# Altium schematic sheet Nucleo.SchDoc
size A; SheetNumber: 6; SheetTotal: 5
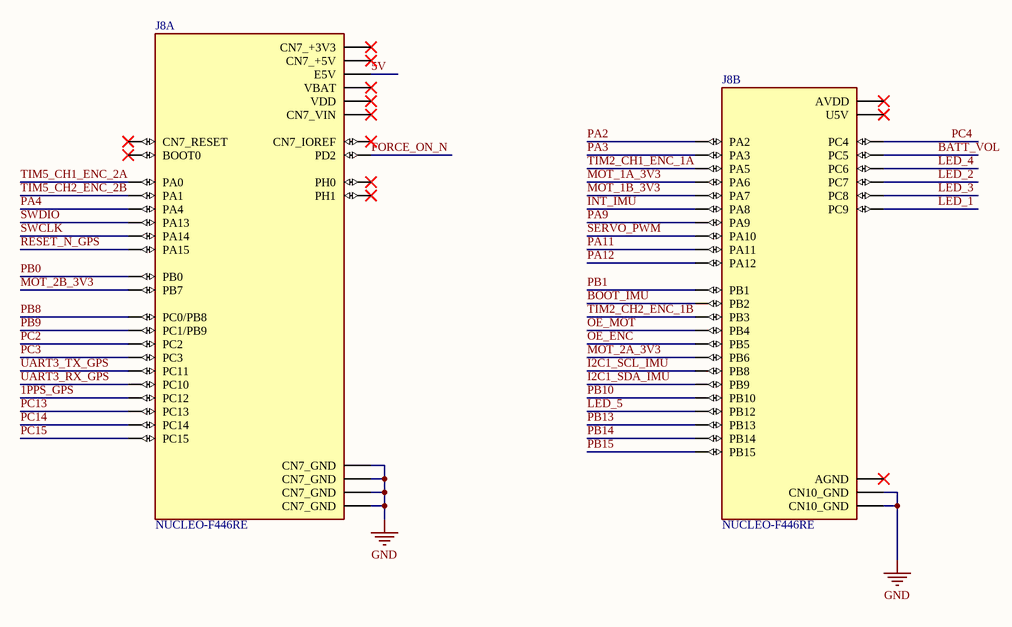
[diagram p0: Nucleo.SchDoc]

## Parts
J8  NUCLEO-F446RE  [MODULE_NUCLEO-F446RE]  (parts A,B of 6)

## Nets
GND: J8.CN7_8(CN7_GND) J8.CN7_19(CN7_GND) J8.CN7_20(CN7_GND) J8.CN7_22(CN7_GND) J8.CN10_9(CN10_GND) J8.CN10_20(CN10_GND)
1PPS_GPS: J8.CN7_3(PC12)
5V: J8.CN7_6(E5V)
BATT_VOL: J8.CN10_6(PC5)
BOOT_IMU: J8.CN10_22(PB2)
FORCE_ON_N: J8.CN7_4(PD2)
I2C1_SCL_IMU: J8.CN10_3(PB8)
I2C1_SDA_IMU: J8.CN10_5(PB9)
INT_IMU: J8.CN10_23(PA8)
LED_1: J8.CN10_1(PC9)
LED_2: J8.CN10_19(PC7)
LED_3: J8.CN10_2(PC8)
LED_4: J8.CN10_4(PC6)
LED_5: J8.CN10_16(PB12)
MOT_1A_3V3: J8.CN10_13(PA6)
MOT_1B_3V3: J8.CN10_15(PA7)
MOT_2A_3V3: J8.CN10_17(PB6)
MOT_2B_3V3: J8.CN7_21(PB7)
OE_ENC: J8.CN10_29(PB5)
OE_MOT: J8.CN10_27(PB4)
PA2: J8.CN10_35(PA2)
PA3: J8.CN10_37(PA3)
PA4: J8.CN7_32(PA4)
PA9: J8.CN10_21(PA9)
PA11: J8.CN10_14(PA11)
PA12: J8.CN10_12(PA12)
PB0: J8.CN7_34(PB0)
PB1: J8.CN10_24(PB1)
PB8: J8.CN7_38(PC0/PB8)
PB9: J8.CN7_36(PC1/PB9)
PB10: J8.CN10_25(PB10)
PB13: J8.CN10_30(PB13)
PB14: J8.CN10_28(PB14)
PB15: J8.CN10_26(PB15)
PC2: J8.CN7_35(PC2)
PC3: J8.CN7_37(PC3)
PC4: J8.CN10_34(PC4)
PC13: J8.CN7_23(PC13)
PC14: J8.CN7_25(PC14)
PC15: J8.CN7_27(PC15)
RESET_N_GPS: J8.CN7_17(PA15)
SERVO_PWM: J8.CN10_33(PA10)
SWCLK: J8.CN7_15(PA14)
SWDIO: J8.CN7_13(PA13)
TIM2_CH1_ENC_1A: J8.CN10_11(PA5)
TIM2_CH2_ENC_1B: J8.CN10_31(PB3)
TIM5_CH1_ENC_2A: J8.CN7_28(PA0)
TIM5_CH2_ENC_2B: J8.CN7_30(PA1)
UART3_RX_GPS: J8.CN7_1(PC10)
UART3_TX_GPS: J8.CN7_2(PC11)

Not connected (* = marked no-connect by the designer): J8 CN7_5(VDD)* CN7_7(BOOT0)* CN7_12(CN7_IOREF)* CN7_14(CN7_RESET)* CN7_16(CN7_+3V3)* CN7_18(CN7_+5V)* CN7_24(CN7_VIN)* CN7_29(PH0)* CN7_31(PH1)* CN7_33(VBAT)* CN10_7(AVDD)* CN10_8(U5V)* CN10_32(AGND)*

## Library data of the parts
J8 = NUCLEO-F446RE: STM32 Nucleo-64 development board with STM32F446RET6 MCU, supports Arduino and ST morpho connectivity; Price: None; MP: NUCLEO-F446RE; Availability: Unavailable; Value: *; Package: None